# EAGLE schematic module_RevC (EAGLE 9.1.1)
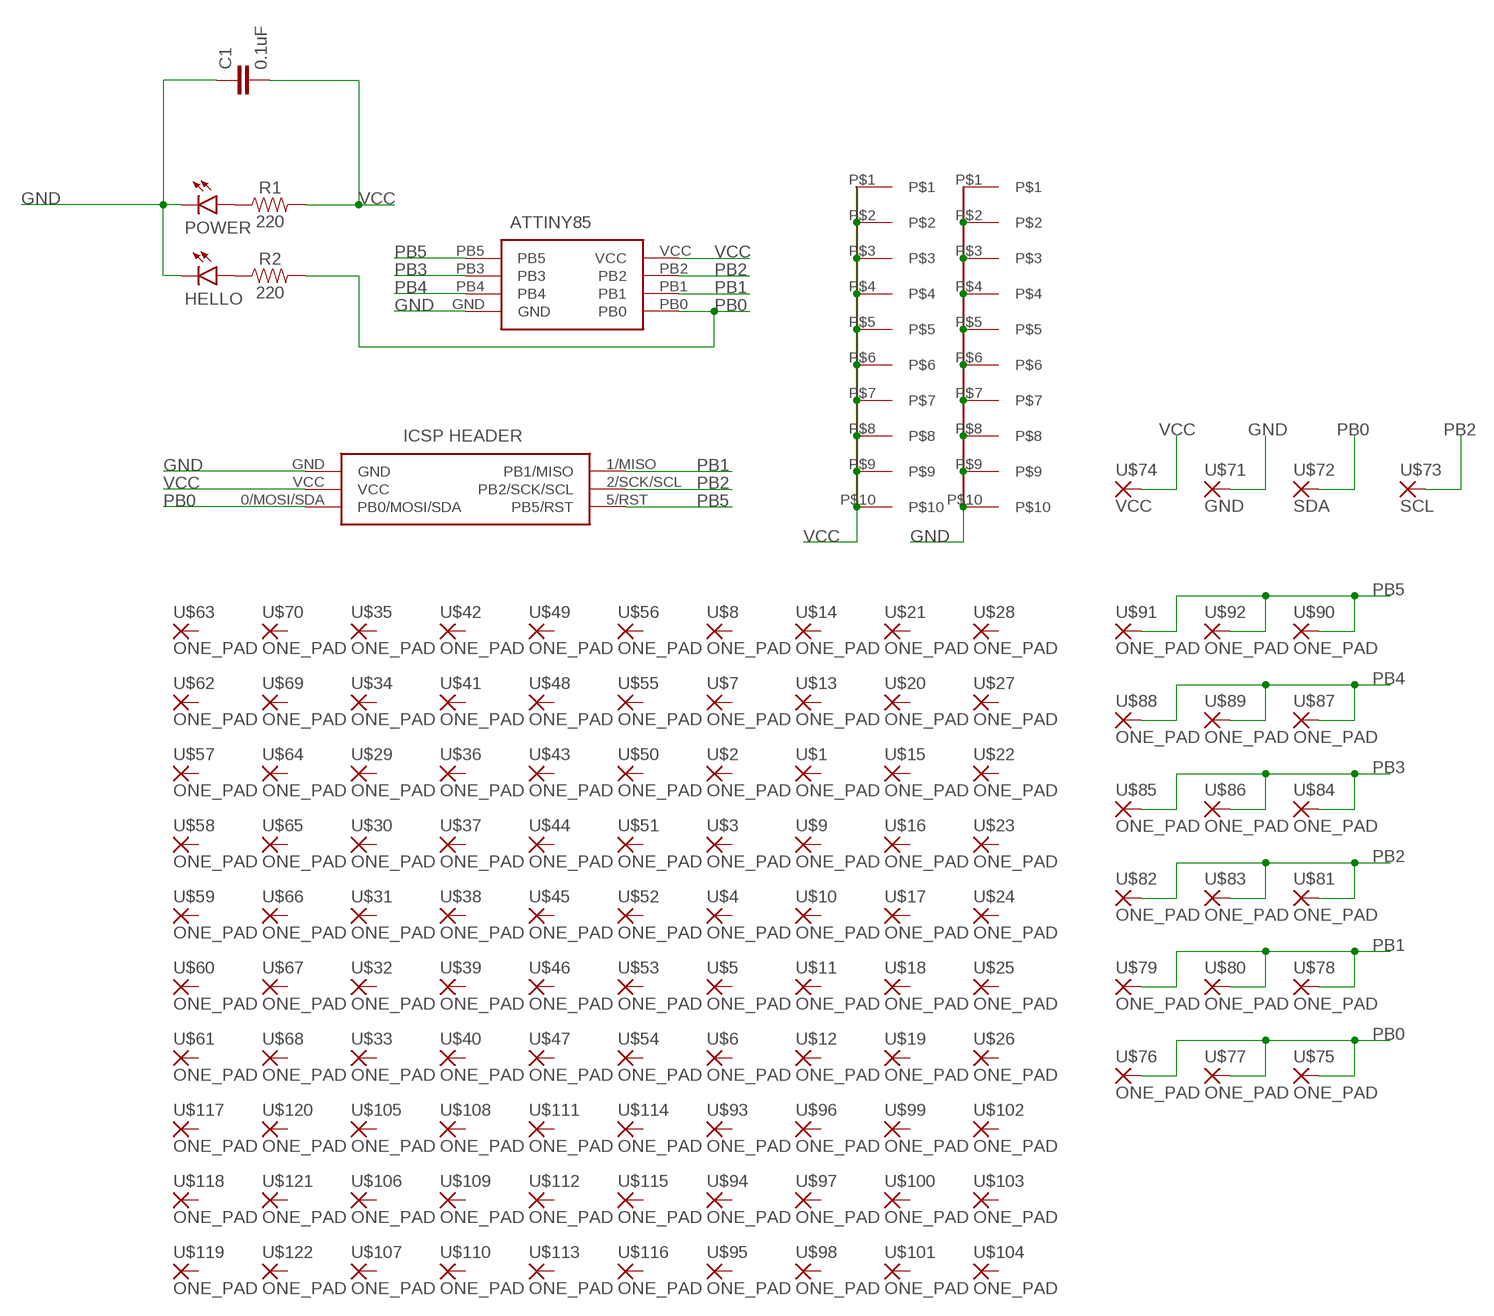
[diagram p0: schematic, sheet 1]

## Parts
C1  0.1uF  0.1UF-0603-25V-5%  [0603]
GND  10X-PADS  [10X-PADS]
HELLO  LED3MM  [LED3MM]
IC1  ATTINY85-20SU  [SOT127P798X216-8N]
J1  M20-9980346  [HDRV6W64P254_2X3_762X508X868P]
POWER  LED3MM  [LED3MM]
R1  220  RESISTORAXIAL-0.3  [AXIAL-0.3]
R2  220  RESISTORAXIAL-0.3  [AXIAL-0.3]
U$1  ONE_PAD  [1X01]
U$2  ONE_PAD  [1X01]
U$3  ONE_PAD  [1X01]
U$4  ONE_PAD  [1X01]
U$5  ONE_PAD  [1X01]
U$6  ONE_PAD  [1X01]
U$7  ONE_PAD  [1X01]
U$8  ONE_PAD  [1X01]
U$9  ONE_PAD  [1X01]
U$10  ONE_PAD  [1X01]
U$11  ONE_PAD  [1X01]
U$12  ONE_PAD  [1X01]
U$13  ONE_PAD  [1X01]
U$14  ONE_PAD  [1X01]
U$15  ONE_PAD  [1X01]
U$16  ONE_PAD  [1X01]
U$17  ONE_PAD  [1X01]
U$18  ONE_PAD  [1X01]
U$19  ONE_PAD  [1X01]
U$20  ONE_PAD  [1X01]
U$21  ONE_PAD  [1X01]
U$22  ONE_PAD  [1X01]
U$23  ONE_PAD  [1X01]
U$24  ONE_PAD  [1X01]
U$25  ONE_PAD  [1X01]
U$26  ONE_PAD  [1X01]
U$27  ONE_PAD  [1X01]
U$28  ONE_PAD  [1X01]
U$29  ONE_PAD  [1X01]
U$30  ONE_PAD  [1X01]
U$31  ONE_PAD  [1X01]
U$32  ONE_PAD  [1X01]
U$33  ONE_PAD  [1X01]
U$34  ONE_PAD  [1X01]
U$35  ONE_PAD  [1X01]
U$36  ONE_PAD  [1X01]
U$37  ONE_PAD  [1X01]
U$38  ONE_PAD  [1X01]
U$39  ONE_PAD  [1X01]
U$40  ONE_PAD  [1X01]
U$41  ONE_PAD  [1X01]
U$42  ONE_PAD  [1X01]
U$43  ONE_PAD  [1X01]
U$44  ONE_PAD  [1X01]
U$45  ONE_PAD  [1X01]
U$46  ONE_PAD  [1X01]
U$47  ONE_PAD  [1X01]
U$48  ONE_PAD  [1X01]
U$49  ONE_PAD  [1X01]
U$50  ONE_PAD  [1X01]
U$51  ONE_PAD  [1X01]
U$52  ONE_PAD  [1X01]
U$53  ONE_PAD  [1X01]
U$54  ONE_PAD  [1X01]
U$55  ONE_PAD  [1X01]
U$56  ONE_PAD  [1X01]
U$57  ONE_PAD  [1X01]
U$58  ONE_PAD  [1X01]
U$59  ONE_PAD  [1X01]
U$60  ONE_PAD  [1X01]
U$61  ONE_PAD  [1X01]
U$62  ONE_PAD  [1X01]
U$63  ONE_PAD  [1X01]
U$64  ONE_PAD  [1X01]
U$65  ONE_PAD  [1X01]
U$66  ONE_PAD  [1X01]
U$67  ONE_PAD  [1X01]
U$68  ONE_PAD  [1X01]
U$69  ONE_PAD  [1X01]
U$70  ONE_PAD  [1X01]
U$71  GND  ONE_PAD  [1X01]
U$72  SDA  ONE_PAD  [1X01]
U$73  SCL  ONE_PAD  [1X01]
U$74  VCC  ONE_PAD  [1X01]
U$75  ONE_PAD  [1X01]
U$76  ONE_PAD  [1X01]
U$77  ONE_PAD  [1X01]
U$78  ONE_PAD  [1X01]
U$79  ONE_PAD  [1X01]
U$80  ONE_PAD  [1X01]
U$81  ONE_PAD  [1X01]
U$82  ONE_PAD  [1X01]
U$83  ONE_PAD  [1X01]
U$84  ONE_PAD  [1X01]
U$85  ONE_PAD  [1X01]
U$86  ONE_PAD  [1X01]
U$87  ONE_PAD  [1X01]
U$88  ONE_PAD  [1X01]
U$89  ONE_PAD  [1X01]
U$90  ONE_PAD  [1X01]
U$91  ONE_PAD  [1X01]
U$92  ONE_PAD  [1X01]
U$93  ONE_PAD  [1X01]
U$94  ONE_PAD  [1X01]
U$95  ONE_PAD  [1X01]
U$96  ONE_PAD  [1X01]
U$97  ONE_PAD  [1X01]
U$98  ONE_PAD  [1X01]
U$99  ONE_PAD  [1X01]
U$100  ONE_PAD  [1X01]
U$101  ONE_PAD  [1X01]
U$102  ONE_PAD  [1X01]
U$103  ONE_PAD  [1X01]
U$104  ONE_PAD  [1X01]
U$105  ONE_PAD  [1X01]
U$106  ONE_PAD  [1X01]
U$107  ONE_PAD  [1X01]
U$108  ONE_PAD  [1X01]
U$109  ONE_PAD  [1X01]
U$110  ONE_PAD  [1X01]
U$111  ONE_PAD  [1X01]
U$112  ONE_PAD  [1X01]
U$113  ONE_PAD  [1X01]
U$114  ONE_PAD  [1X01]
U$115  ONE_PAD  [1X01]
U$116  ONE_PAD  [1X01]
U$117  ONE_PAD  [1X01]
U$118  ONE_PAD  [1X01]
U$119  ONE_PAD  [1X01]
U$120  ONE_PAD  [1X01]
U$121  ONE_PAD  [1X01]
U$122  ONE_PAD  [1X01]
VCC  10X-PADS  [10X-PADS]

## Nets
GND [GND]: C1.1 GND.P$1 GND.P$2 GND.P$3 GND.P$4 GND.P$5 GND.P$6 GND.P$7 GND.P$8 GND.P$9 GND.P$10 HELLO.NEG IC1.GND J1.GND POWER.NEG U$71.1(P)
N$1: POWER.POS R1.P$1
N$3: HELLO.POS R2.P$1
PB0: IC1.PB0 J1.0/MOSI/SDA(PB0/MOSI/SDA) R2.P$2 U$72.1(P) U$75.1(P) U$76.1(P) U$77.1(P)
PB1: IC1.PB1 J1.1/MISO(PB1/MISO) U$78.1(P) U$79.1(P) U$80.1(P)
PB2: IC1.PB2 J1.2/SCK/SCL(PB2/SCK/SCL) U$73.1(P) U$81.1(P) U$82.1(P) U$83.1(P)
PB3: IC1.PB3 U$84.1(P) U$85.1(P) U$86.1(P)
PB4: IC1.PB4 U$87.1(P) U$88.1(P) U$89.1(P)
PB5: IC1.PB5 J1.5/RST(PB5/RST) U$90.1(P) U$91.1(P) U$92.1(P)
VCC [VCC]: C1.2 IC1.VCC J1.VCC R1.P$2 U$74.1(P) VCC.P$1 VCC.P$2 VCC.P$3 VCC.P$4 VCC.P$5 VCC.P$6 VCC.P$7 VCC.P$8 VCC.P$9 VCC.P$10
Unconnected: U$1.1(P) U$2.1(P) U$3.1(P) U$4.1(P) U$5.1(P) U$6.1(P) U$7.1(P) U$8.1(P) U$9.1(P) U$10.1(P) U$11.1(P) U$12.1(P) U$13.1(P) U$14.1(P) U$15.1(P) U$16.1(P) U$17.1(P) U$18.1(P) U$19.1(P) U$20.1(P) U$21.1(P) U$22.1(P) U$23.1(P) U$24.1(P) U$25.1(P) U$26.1(P) U$27.1(P) U$28.1(P) U$29.1(P) U$30.1(P) U$31.1(P) U$32.1(P) U$33.1(P) U$34.1(P) U$35.1(P) U$36.1(P) U$37.1(P) U$38.1(P) U$39.1(P) U$40.1(P) U$41.1(P) U$42.1(P) U$43.1(P) U$44.1(P) U$45.1(P) U$46.1(P) U$47.1(P) U$48.1(P) U$49.1(P) U$50.1(P) U$51.1(P) U$52.1(P) U$53.1(P) U$54.1(P) U$55.1(P) U$56.1(P) U$57.1(P) U$58.1(P) U$59.1(P) U$60.1(P) U$61.1(P) U$62.1(P) U$63.1(P) U$64.1(P) U$65.1(P) U$66.1(P) U$67.1(P) U$68.1(P) U$69.1(P) U$70.1(P) U$93.1(P) U$94.1(P) U$95.1(P) U$96.1(P) U$97.1(P) U$98.1(P) U$99.1(P) U$100.1(P) U$101.1(P) U$102.1(P) U$103.1(P) U$104.1(P) U$105.1(P) U$106.1(P) U$107.1(P) U$108.1(P) U$109.1(P) U$110.1(P) U$111.1(P) U$112.1(P) U$113.1(P) U$114.1(P) U$115.1(P) U$116.1(P) U$117.1(P) U$118.1(P) U$119.1(P) U$120.1(P) U$121.1(P) U$122.1(P)

## Library data of the parts
C1 = SparkFun-Capacitors:0.1UF: 0.1µF ceramic capacitors A capacitor is a passive two-terminal electrical component used to store electrical energy temporarily in an electric field.; PROD_ID: CAP-08604
GND VCC = BadgeParts:10X-PADS
HELLO POWER = BadgeParts:LED3MM
IC1 = BadgeParts:ATTINY85-20SU: MICROCHIP - ATTINY85-20SU - MICROCONTROLLER MCU, 8 BIT, ATTINY, 20MHZ, SOIC-8 Source: Datasheet <https://componentsearchengine.com/Datasheets/2/ATTINY85-20SU.pdf>; ARROW_PART_NUMBER: ATTINY85-20SU; ARROW_PRICE/STOCK: https://www.arrow.com/en/products/attiny85-20su/microchip-technology; DESCRIPTION: MICROCHIP - ATTINY85-20SU - MICROCONTROLLER MCU, 8 BIT, ATTINY, 20MHZ, SOIC-8; HEIGHT: 2.16mm; MANUFACTURER_NAME: Microchip; MANUFACTURER_PART_NUMBER: ATTINY85-20SU; RS_PART_NUMBER: 1331674; RS_PRICE/STOCK: http://uk.rs-online.com/web/p/products/1331674
J1 = BadgeParts:M20-9980346: 03+03 DIL Vertical Pin Header HARWIN M20 Series, 2.54mm Pitch 6 Way 2 Row Straight PCB Header, Solder Termination, 3A Source: Datasheet <https://cdn.harwin.com/pdfs/M20-998.pdf?utm_source=3D_PDF&utm_medium=3D_PDF&utm_campaign=3D_PDF>; ARROW_PART_NUMBER: M20-9980346; ARROW_PRICE/STOCK: http://uk.rs-online.com/web/p/products/7457046P; DESCRIPTION: 03+03 DIL Vertical Pin Header HARWIN M20 Series, 2.54mm Pitch 6 Way 2 Row Straight PCB Header, Solder Termination, 3A; HEIGHT: 8.68mm; MANUFACTURER_NAME: HARWIN; MANUFACTURER_PART_NUMBER: M20-9980346; RS_PART_NUMBER: 7457046P; RS_PRICE/STOCK: http://uk.rs-online.com/web/p/products/7457046P
R1 R2 = SparkFun-Resistors:RESISTOR: Generic Resistor Package
U$1-U$122 = BadgeParts:ONE_PAD

## Net classes
0 default: width 0.254 mm, clearance 0.381 mm
1 VCC: width 0.635 mm, clearance 0.381 mm
2 GND: width 0.635 mm, clearance 0.381 mm